# EAGLE design EMBEDDED (EAGLE 6.5.0)
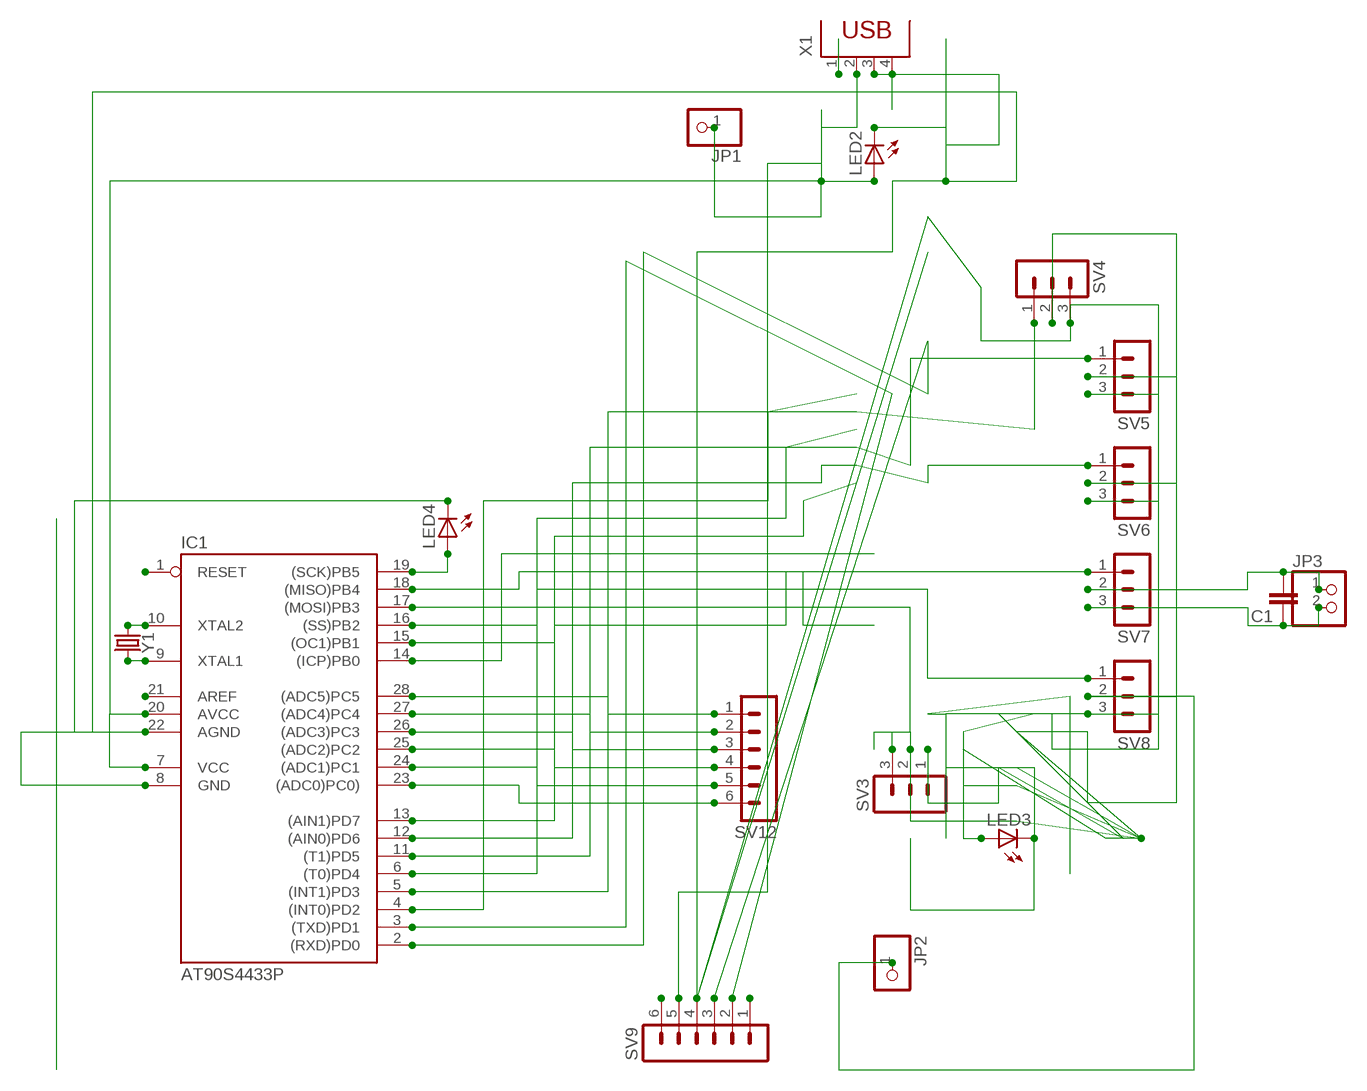
[diagram p0: schematic, sheet 1]

## Parts
C1  C5/2.5  [C5B2.5]
IC1  AT90S4433P  [DIL28-3]
JP1  PINHD-1X1  [1X01]
JP2  PINHD-1X1  [1X01]
JP3  PINHD-1X2  [1X02]
LED2  LEDLD260  [LD260]
LED3  LEDLD260  [LD260]
LED4  LEDLD260  [LD260]
SV3  MA03-1  [MA03-1]
SV4  MA03-1  [MA03-1]
SV5  MA03-1  [MA03-1]
SV6  MA03-1  [MA03-1]
SV7  MA03-1  [MA03-1]
SV8  MA03-1  [MA03-1]
SV9  MA06-1  [MA06-1]
SV12  MA06-1  [MA06-1]
X1  PN61729  [PN61729]
Y1  CRYSTALPTH-HC49US  [HC49US]

## Nets
GROUND: C1.1 IC1.8(GND) IC1.22(AGND) JP3.2 LED2.K(C) LED3.K(C) LED4.K(C) SV3.1 SV4.3 SV5.3 SV6.3 SV7.3 SV8.3 SV9.4 X1.3
N$1: IC1.17((MOSI)PB3) SV3.3
N$3: X1.1
N$4: X1.4
N$5: C1.2 JP2.1 JP3.1 LED3.A SV3.2 SV4.2 SV5.2 SV6.2 SV7.2 SV8.2
N$10: IC1.16((SS)PB2) SV8.1
N$12: IC1.15((OC1)PB1) SV7.1
N$15: IC1.12((AIN0)PD6) SV6.1
N$18: IC1.28((ADC5)PC5) SV12.1
N$19: IC1.11((T1)PD5) SV5.1
N$20: IC1.21(AREF)
N$21: IC1.9(XTAL1) Y1.2
N$22: IC1.5((INT1)PD3) SV4.1
N$23: SV9.6
N$24: IC1.27((ADC4)PC4) SV12.2
N$25: IC1.26((ADC3)PC3) SV12.3
N$26: IC1.2((RXD)PD0) SV9.3
N$27: IC1.3((TXD)PD1) SV9.2
N$28: SV9.1
N$29: IC1.25((ADC2)PC2) SV12.4
N$30: IC1.24((ADC1)PC1) SV12.5
N$31: IC1.23((ADC0)PC0)) SV12.6
N$32: IC1.10(XTAL2) Y1.1
N$33: IC1.1(RESET)
N$35: IC1.4((INT0)PD2)
N$37: IC1.6((T0)PD4)
N$40: IC1.13((AIN1)PD7)
N$41: IC1.14((ICP)PB0)
N$46: IC1.18((MISO)PB4)
N$54: IC1.19((SCK)PB5) LED4.A
VOLTAGE: IC1.7(VCC) IC1.20(AVCC) JP1.1 LED2.A SV9.5 X1.2

## Library data of the parts
C1 = capacitor-wima:C: CAPACITOR naming: grid - package width
IC1 = atmel:AT90S4433: MICROCONTROLLER 4 Kbytes FLASH 128 bytes SRAM 256 bytes EEPROM UART 6-channel 10 bit ADC; OC_FARNELL: unknown; OC_NEWARK: unknown
JP1 JP2 = pinhead:PINHD-1X1: PIN HEADER
JP3 = pinhead:PINHD-1X2: PIN HEADER
LED2-LED4 = led:LED: LED OSRAM: - CHIPLED LG R971, LG N971, LY N971, LG Q971, LY Q971, LO R971, LY R971 LH N974, LH R974 LS Q976, LO Q976, LY Q976 LO Q996 - Hyper CHIPLED LW Q18S LB Q993, LB Q99A, LB R99A - SideLED LS A670, LO A670, LY A670, LG A670, LP A670 LB A673, LV A673, LT A673, LW A673 LH A674 LY A675 LS A676, LA A676, LO A676, LY A676, LW A676 LS A679, LY A679, LG A679 - Hyper Micro SIDELED® LS Y876, LA Y876, LO Y876, LY Y876 LT Y87S - SmartLED LW L88C, LW L88S LB L89C, LB L89S, LG L890 LS L89K, LO L89K, LY L89K LS L896, LA L896, LO L896, LY L896 - TOPLED LS T670, LO T670, LY T670, LG T670, LP T670 LSG T670, LSP T670, LSY T670, LOP T670, LYG T670 LG T671, LOG T671, LSG T671 LB T673, LV T673, LT T673, LW T673 LH T674 LS T676, LA T676, LO T676, LY T676, LB T676, LH T676, LSB T676, LW T676 LB T67C, LV T67C, LT T67C, LS T67K, LO T67K, LY T67K, LW E67C LS E67B, LA E67B, LO E67B, LY E67B, LB E67C, LV E67C, LT E67C LW T67C LS T679, LY T679, LG T679 LS T770, LO T770, LY T770, LG T770, LP T770 LB T773, LV T773, LT T773, LW T773 LH T774 LS E675, LA E675, LY E675, LS T675 LS T776, LA T776, LO T776, LY T776, LB T776 LHGB T686 LT T68C, LB T68C - Hyper Mini TOPLED® LB M676 - Mini TOPLED Santana® LG M470 LS M47K, LO M47K, LY M47K Source: http://www.osram.convergy.de LUXEON: - LUMILED® LXK2-PW12-R00, LXK2-PW12-S00, LXK2-PW14-U00, LXK2-PW14-V00 LXK2-PM12-R00, LXK2-PM12-S00, LXK2-PM14-U00 LXK2-PE12-Q00, LXK2-PE12-R00, LXK2-PE12-S00, LXK2-PE14-T00, LXK2-PE14-U00 LXK2-PB12-K00, LXK2-PB12-L00, LXK2-PB12-M00, LXK2-PB14-N00, LXK2-PB14-P00, LXK2-PB14-Q00 LXK2-PR12-L00, LXK2-PR12-M00, LXK2-PR14-Q00, LXK2-PR14-R00 LXK2-PD12-Q00, LXK2-PD12-R00, LXK2-PD12-S00 LXK2-PH12-R00, LXK2-PH12-S00 LXK2-PL12-P00, LXK2-PL12-Q00, LXK2-PL12-R00 Source: www.luxeon.com KINGBRIGHT: KA-3528ASYC Source: www.kingbright.com
SV3-SV8 = con-lstb:MA03-1: PIN HEADER; OC_FARNELL: unknown; OC_NEWARK: unknown
SV9 SV12 = con-lstb:MA06-1: PIN HEADER; OC_FARNELL: unknown; OC_NEWARK: unknown
X1 = con-berg:PN61729: BERG USB connector; OC_FARNELL: unknown; OC_NEWARK: unknown
Y1 = SparkFun-Clocks:CRYSTAL: Crystals (Generic) These are passive quartz crystals, which can be used as a clock source for a microcontroller. Crystal's are two-terminal devices. They require external "load" capacitors to generate an oscillating signal.

## Board
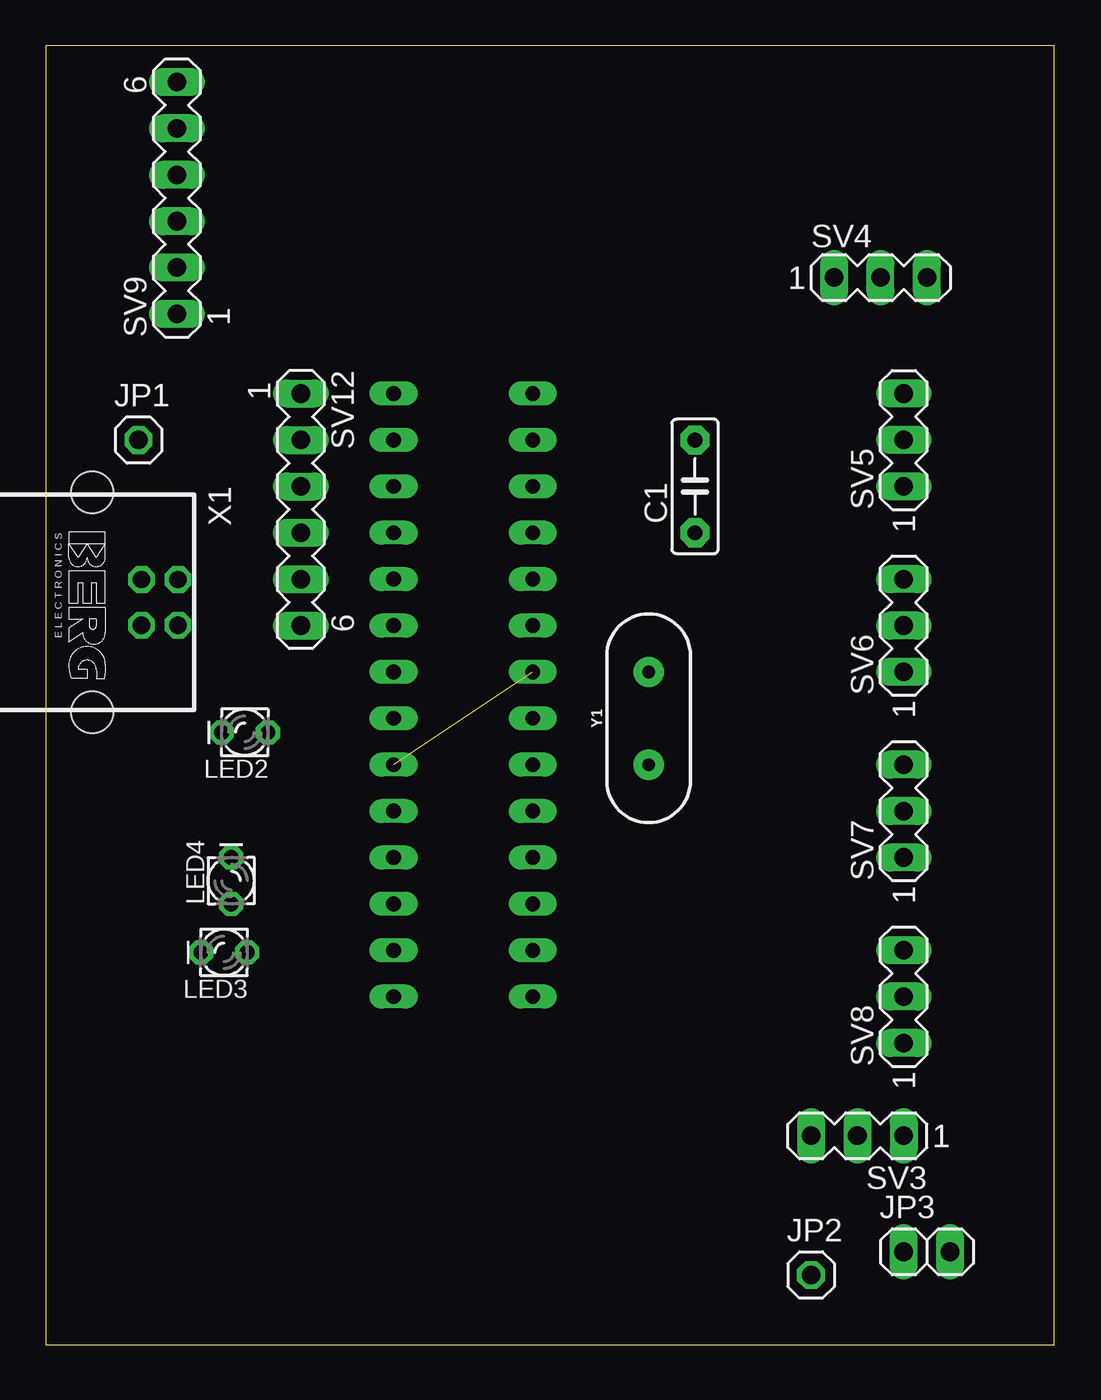
[diagram p1: board, top side]
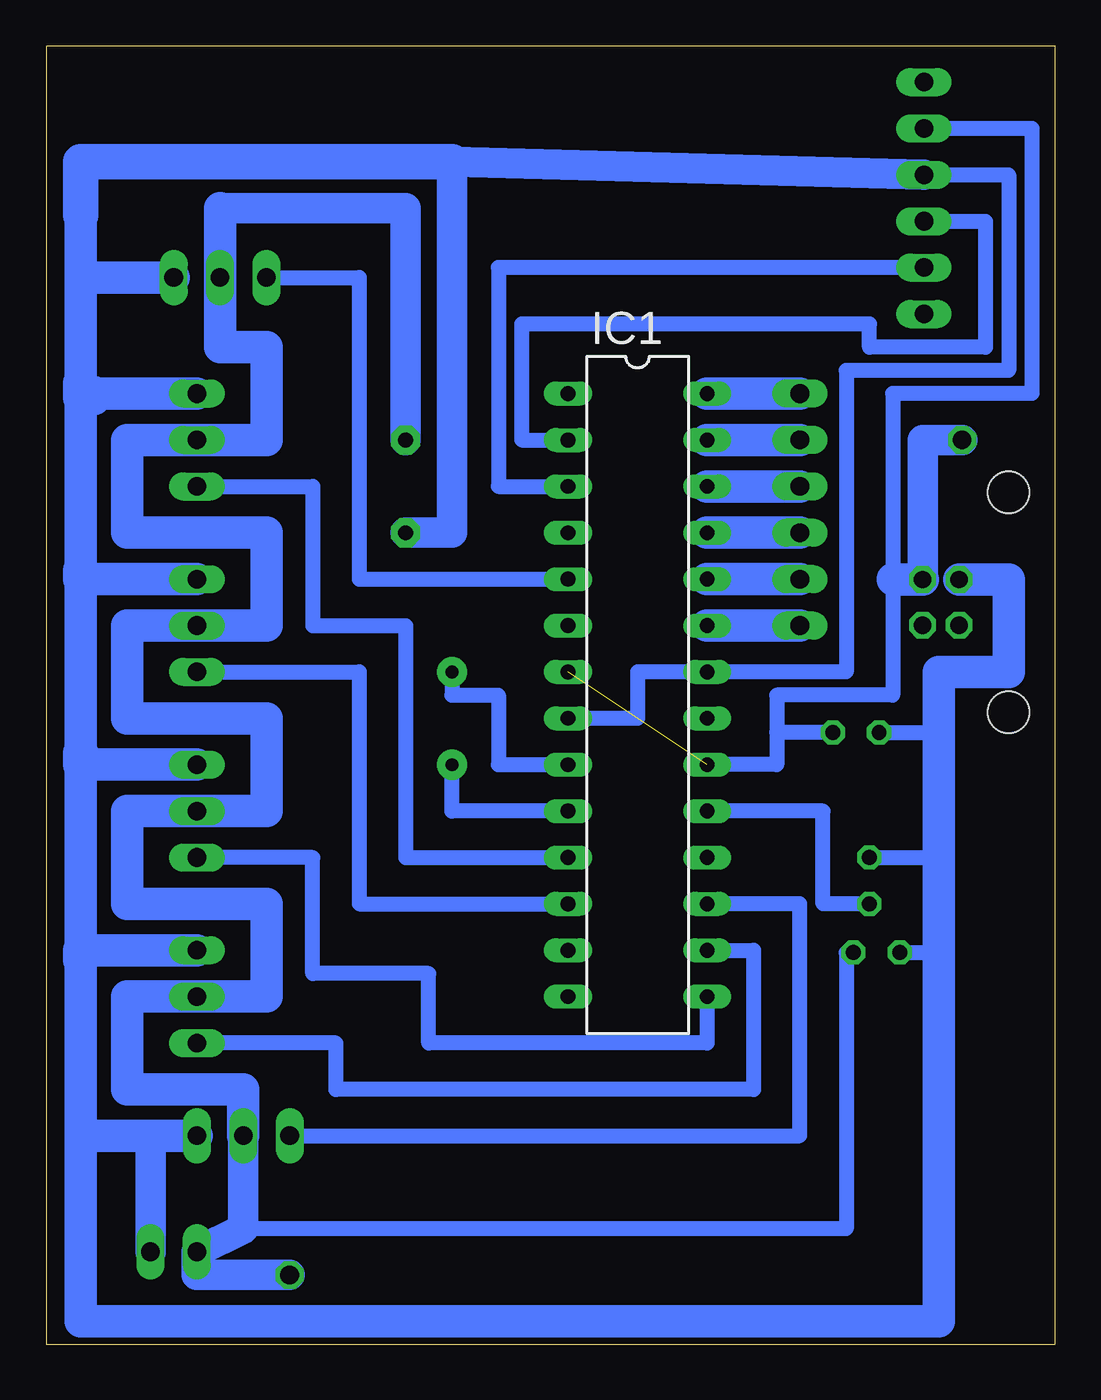
[diagram p2: board, bottom side, seen from below]

Size 55.22 x 71.12 mm. Coordinates in mm from the lower left corner, seen from the top.
Outline: 0,0 55.22,0 55.22,71.12 6.35,71.12 0,71.11 0,0
Copper layers (1*16): Top 0.035mm / dielectric 1.5mm / Bottom 0.035mm
Design rules "default": minimum track width 10mil, minimum drill 24mil, track to track 8mil, track to pad 8mil, pad to pad 8mil, via to via 8mil, smd to smd 8mil, copper to edge 40mil, drill to drill 8mil, minimum pad ring 10mil, minimum via ring 8mil, stop-mask expansion 4mil, vias tented up to drill 0mil, thermal gap 10mil

### Footprints (pad centres in the part's own frame; a part is rotated, then mirrored left to right if it is on the bottom)
C5B2.5 = drill 0.813 pad 1.6 octagon: 1 -2.54,0; 2 2.54,0
DIL28-3 = drill 0.813 long: 1 -16.51,-3.81; 2 -13.97,-3.81; 3 -11.43,-3.81; 4 -8.89,-3.81; 5 -6.35,-3.81; 6 -3.81,-3.81; 7 -1.27,-3.81; 8 1.27,-3.81; 9 3.81,-3.81; 10 6.35,-3.81; 11 8.89,-3.81; 12 11.43,-3.81; 13 13.97,-3.81; 14 16.51,-3.81; 15 16.51,3.81; 16 13.97,3.81; 17 11.43,3.81; 18 8.89,3.81; 19 6.35,3.81; 20 3.81,3.81; 21 1.27,3.81; 22 -1.27,3.81; 23 -3.81,3.81; 24 -6.35,3.81; 25 -8.89,3.81; 26 -11.43,3.81; 27 -13.97,3.81; 28 -16.51,3.81
1X01 = drill 1.016 octagon: 1 0,0
1X02 = drill 1.016 long: 1 -1.27,0; 2 1.27,0
LD260 = drill 0.813 octagon: A -1.27,0; K 1.27,0
MA03-1 = drill 1.016 long: 1 -2.54,0; 2 0,0; 3 2.54,0
MA06-1 = drill 1.016 long: 1 -6.35,0; 2 -3.81,0; 3 -1.27,0; 4 1.27,0; 5 3.81,0; 6 6.35,0
PN61729 = drill 0.95 octagon: 1 1.25,4.71; 2 -1.25,4.71; 3 -1.25,2.71; 4 1.25,2.71 | hole 2.3: -6.02,0; 6.02,0
HC49US = drill 0.7 pad 1.651: 1 -2.54,0; 2 2.54,0

### Placement (x,y rotation side)
C1  35.56,46.99 90 top
IC1  22.86,35.56 270 bottom
JP1  5.08,49.53 0 top
JP2  41.91,3.81 0 top
JP3  48.26,5.08 0 top
LED2  10.9,33.52 180 top
LED3  9.77,21.47 180 top
LED4  10.16,25.4 90 top
SV3  44.45,11.43 180 top
SV4  45.72,58.42 0 top
SV5  46.99,49.53 90 top
SV6  46.99,39.37 90 top
SV7  46.99,29.21 90 top
SV8  46.99,19.05 90 top
SV9  7.18,62.78 90 top
SV12  13.97,45.72 270 top
X1  2.54,40.64 270 top
Y1  33.02,34.29 90 top

### Tracks (layer width: path | path; a pad name or v marks a point on that pad's centre or on a via)
GROUND
  Bottom 0.813: SV9.4 2.54,64.05 2.54,53.34 11.43,53.34 11.43,36.83 IC1.22 22.86,36.83 22.86,34.29 IC1.8 | LED2.K 6.35,33.52 | LED4.K 6.35,26.67 | LED3.K 6.35,21.47 6.35,21.59
  Bottom 1.676: 53.34,11.43 53.34,11.61 52.91,11.61 52.91,11.43 | C1.1 33.02,44.45 33.02,64.77 SV9.4 | JP3.2 49.53,11.43
  Bottom 1.778: 53.34,21.06 53.34,11.61 53.34,1.27 6.35,1.27 6.35,21.59 6.35,26.67 6.35,33.52 6.35,36.83 2.54,36.83 2.54,41.89 X1.3 | 53.34,61.83 53.34,58.42 | 53.34,58.42 53.34,52.65 | 53.34,42.39 53.34,52.07 SV5.3 | 53.34,32.4 53.34,41.91 SV6.3 | SV7.3 53.34,31.75 53.34,21.59 SV8.3 | SV3.1 49.53,11.43 53.34,11.43 | SV4.3 53.34,58.42
  Bottom 1.93: 53.34,21.59 53.34,21.06 | 53.34,31.75 53.34,32.4 | 53.34,41.91 53.34,42.39 | 52.64,52.07 52.64,51.84 53.34,51.84 53.34,52.07 53.34,52.65 | 33.02,64.77 53.34,64.77 53.34,61.83
N$1
  Bottom 0.813: SV3.3 13.97,11.43 13.97,24.13 IC1.17
N$5
  Bottom 0.813: LED3.A 11.43,21.47 11.43,6.35 44.45,6.35
  Bottom 1.676: C1.2 35.56,62.23 45.72,62.23 | SV3.2 44.45,6.35 JP3.1 46.99,3.81 JP2.1
  Bottom 1.778: SV3.2 44.45,13.97 50.8,13.97 50.8,19.05 SV8.2 43.18,19.05 43.18,24.13 50.8,24.13 50.8,29.21 SV7.2 43.18,29.21 43.18,34.29 50.8,34.29 50.8,39.37 SV6.2 43.18,39.37 43.18,44.45 50.8,44.45 50.8,49.53 SV5.2 43.18,49.53 43.18,54.61 45.72,54.61 SV4.2 45.72,62.23
N$10
  Bottom 0.813: IC1.16 16.51,21.59 16.51,13.97 39.37,13.97 39.37,16.51 SV8.1
N$12
  Bottom 0.813: IC1.15 19.05,16.51 34.29,16.51 34.29,20.32 40.64,20.32 40.64,26.67 SV7.1
N$15
  Bottom 0.813: SV6.1 38.1,36.83 38.1,24.13 IC1.12
N$18
  Bottom 1.778: SV12.1 IC1.28
N$19
  Bottom 0.813: SV5.1 40.64,46.99 40.64,39.37 35.56,39.37 35.56,26.67 IC1.11
N$21
  Bottom 0.813: Y1.2 33.02,35.56 30.48,35.56 30.48,31.75 IC1.9
N$22
  Bottom 0.813: SV4.1 38.1,58.42 38.1,41.91 IC1.5
N$24
  Bottom 1.778: SV12.2 IC1.27
N$25
  Bottom 1.778: SV12.3 IC1.26
N$26
  Bottom 0.813: SV9.3 3.81,61.51 3.81,54.61 10.16,54.61 10.16,55.88 29.21,55.88 29.21,49.53 IC1.2
N$27
  Bottom 0.813: SV9.2 30.48,58.97 30.48,46.99 IC1.3
N$29
  Bottom 1.778: SV12.4 IC1.25
N$30
  Bottom 1.778: SV12.5 IC1.24
N$31
  Bottom 1.778: SV12.6 IC1.23
N$32
  Bottom 0.813: IC1.10 33.02,29.21 Y1.1
N$54
  Bottom 0.813: LED4.A 12.7,24.13 12.7,29.21 IC1.19
VOLTAGE  (1 unrouted)
  Bottom 0.813: SV9.5 1.27,66.59 1.27,52.07 8.89,52.07 8.89,41.91 8.89,35.56 15.24,35.56 15.24,33.52 | IC1.20 15.24,31.75 15.24,33.52 | LED2.A 15.24,33.52
  Bottom 1.676: JP1.1 7.25,49.53 X1.2
  Bottom 1.778: X1.2 8.89,41.89 8.89,41.91